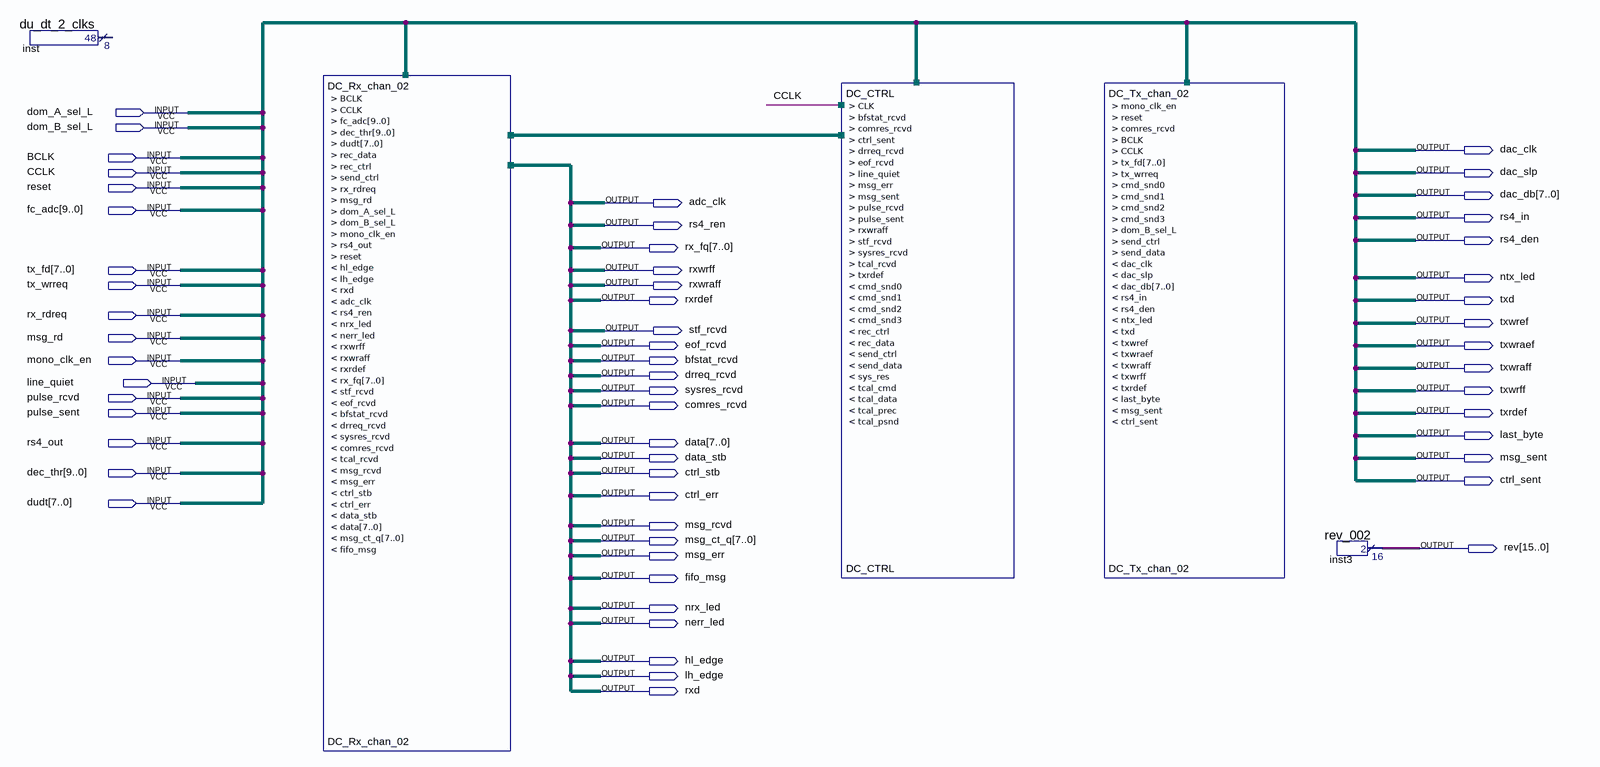
[diagram p0: schematic sheet]
// Quartus schematic dcom_02.bdf as structural Verilog: 5 symbols, 58 pins
module dcom_02 (
  input  dom_A_sel_L,
  input  dom_B_sel_L,
  input  BCLK,
  input  CCLK,
  input  reset,
  input  [9:0] fc_adc,
  input  [7:0] tx_fd,
  input  tx_wrreq,
  input  rx_rdreq,
  input  msg_rd,
  input  mono_clk_en,
  input  line_quiet,
  input  pulse_rcvd,
  input  pulse_sent,
  input  rs4_out,
  input  [9:0] dec_thr,
  input  [7:0] dudt,
  output dac_clk,
  output dac_slp,
  output [7:0] dac_db,
  output adc_clk,
  output rs4_in,
  output rs4_ren,
  output rs4_den,
  output [7:0] rx_fq,
  output rxwrff,
  output ntx_led,
  output rxwraff,
  output rxrdef,
  output txd,
  output txwref,
  output stf_rcvd,
  output eof_rcvd,
  output txwraef,
  output bfstat_rcvd,
  output txwraff,
  output drreq_rcvd,
  output sysres_rcvd,
  output txwrff,
  output comres_rcvd,
  output txrdef,
  output last_byte,
  output [7:0] data,
  output data_stb,
  output msg_sent,
  output ctrl_stb,
  output ctrl_sent,
  output ctrl_err,
  output msg_rcvd,
  output [7:0] msg_ct_q,
  output [15:0] rev,
  output msg_err,
  output fifo_msg,
  output nrx_led,
  output nerr_led,
  output hl_edge,
  output lh_edge,
  output rxd
);

  wire cmd_snd0, cmd_snd1, cmd_snd2, cmd_snd3, rec_ctrl, rec_data, send_ctrl, send_data, tcal_rcvd;

  du_dt_2_clks inst ();  // open: result
  DC_Rx_chan_02 DC_Rx_chan_02 (
    .BCLK(BCLK), .CCLK(CCLK), .fc_adc(fc_adc), .dec_thr(dec_thr), .dudt(dudt), .rec_data(rec_data),
    .rec_ctrl(rec_ctrl), .send_ctrl(send_ctrl), .rx_rdreq(rx_rdreq), .msg_rd(msg_rd),
    .dom_A_sel_L(dom_A_sel_L), .dom_B_sel_L(dom_B_sel_L), .mono_clk_en(mono_clk_en), .rs4_out(rs4_out),
    .reset(reset), .hl_edge(hl_edge), .lh_edge(lh_edge), .rxd(rxd), .adc_clk(adc_clk), .rs4_ren(rs4_ren),
    .nrx_led(nrx_led), .nerr_led(nerr_led), .rxwrff(rxwrff), .rxwraff(rxwraff), .rxrdef(rxrdef),
    .rx_fq(rx_fq), .stf_rcvd(stf_rcvd), .eof_rcvd(eof_rcvd), .bfstat_rcvd(bfstat_rcvd),
    .drreq_rcvd(drreq_rcvd), .sysres_rcvd(sysres_rcvd), .comres_rcvd(comres_rcvd), .tcal_rcvd(tcal_rcvd),
    .msg_rcvd(msg_rcvd), .msg_err(msg_err), .ctrl_stb(ctrl_stb), .ctrl_err(ctrl_err), .data_stb(data_stb),
    .data(data), .msg_ct_q(msg_ct_q), .fifo_msg(fifo_msg));
  DC_CTRL DC_CTRL (
    .CLK(CCLK), .bfstat_rcvd(bfstat_rcvd), .comres_rcvd(comres_rcvd), .ctrl_sent(ctrl_sent),
    .drreq_rcvd(drreq_rcvd), .eof_rcvd(eof_rcvd), .line_quiet(line_quiet), .msg_err(msg_err),
    .msg_sent(msg_sent), .pulse_rcvd(pulse_rcvd), .pulse_sent(pulse_sent), .rxwraff(rxwraff),
    .stf_rcvd(stf_rcvd), .sysres_rcvd(sysres_rcvd), .tcal_rcvd(tcal_rcvd), .txrdef(txrdef),
    .cmd_snd0(cmd_snd0), .cmd_snd1(cmd_snd1), .cmd_snd2(cmd_snd2), .cmd_snd3(cmd_snd3), .rec_ctrl(rec_ctrl),
    .rec_data(rec_data), .send_ctrl(send_ctrl), .send_data(send_data));  // open: sys_res, tcal_cmd, tcal_data, tcal_prec, tcal_psnd
  DC_Tx_chan_02 DC_Tx_chan_02 (
    .mono_clk_en(mono_clk_en), .reset(reset), .comres_rcvd(comres_rcvd), .BCLK(BCLK), .CCLK(CCLK),
    .tx_fd(tx_fd), .tx_wrreq(tx_wrreq), .cmd_snd0(cmd_snd0), .cmd_snd1(cmd_snd1), .cmd_snd2(cmd_snd2),
    .cmd_snd3(cmd_snd3), .dom_B_sel_L(dom_B_sel_L), .send_ctrl(send_ctrl), .send_data(send_data),
    .dac_clk(dac_clk), .dac_slp(dac_slp), .dac_db(dac_db), .rs4_in(rs4_in), .rs4_den(rs4_den),
    .ntx_led(ntx_led), .txd(txd), .txwref(txwref), .txwraef(txwraef), .txwraff(txwraff), .txwrff(txwrff),
    .txrdef(txrdef), .last_byte(last_byte), .msg_sent(msg_sent), .ctrl_sent(ctrl_sent));
  rev_002 inst3 (.result(rev));
endmodule
